# EAGLE schematic ADQ_DIP (EAGLE 6.2)
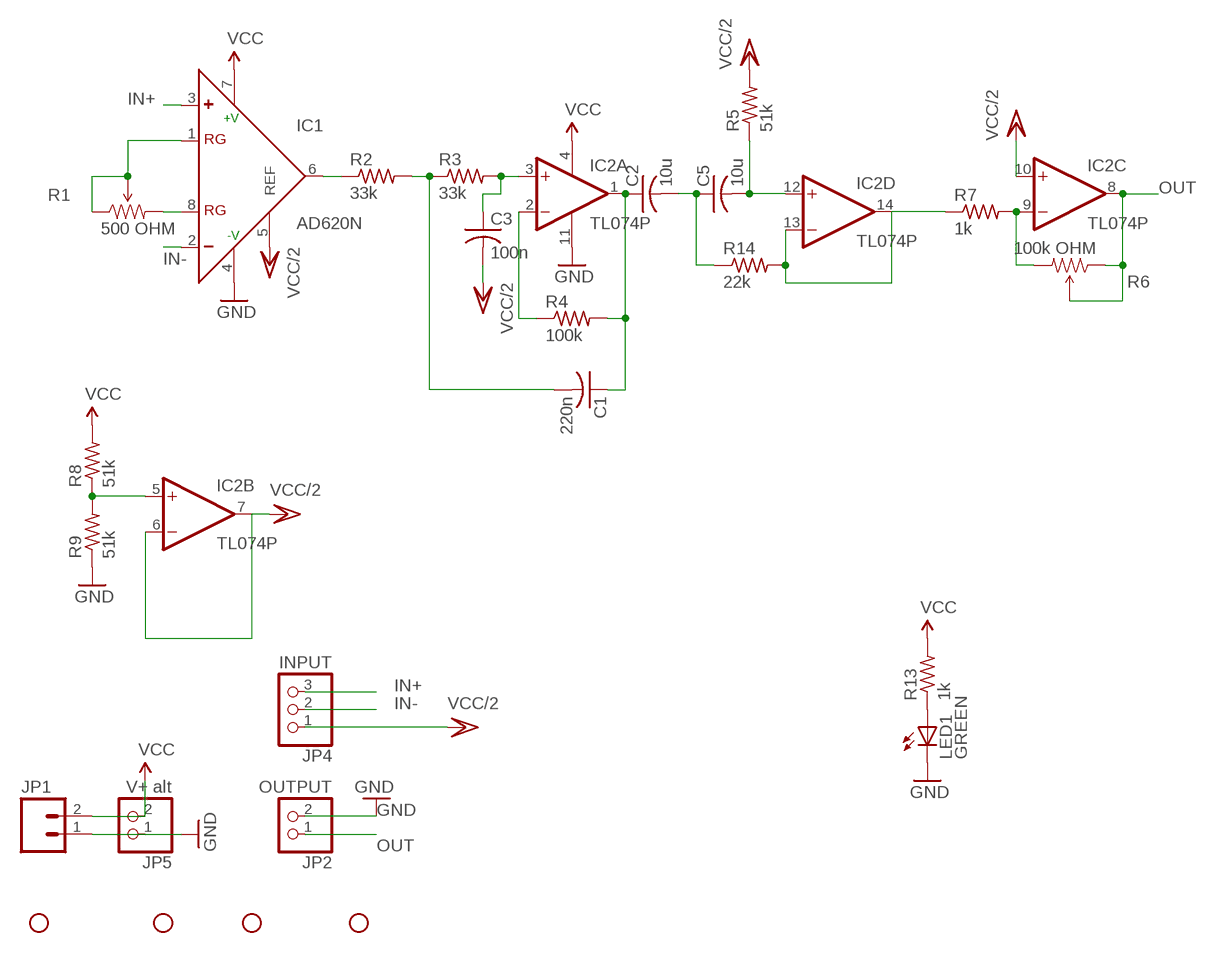
[diagram p0: schematic, sheet 1]

## Parts
C1  220n  C-USC0805  [C0805]
C2  10u  C-USC0805  [C0805]
C3  100n  C-USC0805  [C0805]
C5  10u  C-USC0805  [C0805]
IC1  AD620N  [DIL08]
IC2  TL074P  [DIL14]
JP1  M02JST-PTH-2  [JST-2-PTH]
JP2  OUTPUT  PINHD-1X2  [1X02]
JP3  STAND-OFF  [STAND-OFF]
JP4  INPUT  PINHD-1X3  [1X03]
JP5  V+ alt  PINHD-1X2  [1X02]
JP6  STAND-OFF  [STAND-OFF]
JP7  STAND-OFF  [STAND-OFF]
JP8  STAND-OFF  [STAND-OFF]
LED1  GREEN  LEDCHIPLED_0805  [CHIPLED_0805]
R1  500 OHM  TRIMPOT  [3362U-2]
R2  33k  R-US_R1206  [R1206]
R3  33k  R-US_R1206  [R1206]
R4  100k  R-US_R1206  [R1206]
R5  51k  R-US_R1206  [R1206]
R6  100k OHM  TRIMPOT  [3362U-2]
R7  1k  R-US_R1206  [R1206]
R8  51k  R-US_R1206  [R1206]
R9  51k  R-US_R1206  [R1206]
R13  1k  R-US_R1206  [R1206]
R14  22k  R-US_R1206  [R1206]

## Nets
GND: IC1.4(-V) IC2.11(P:V-) JP1.1 JP2.2 JP5.1 LED1.C R9.1
IN+: IC1.3(+) JP4.3
IN-: IC1.2(-) JP4.2
N$1: IC1.8(RG) R1.3(CW)
N$2: IC1.1(RG) R1.1(CCW) R1.2(WIPER)
N$3: C1.2 R2.2 R3.1
N$4: IC1.6(OUT) R2.1
N$5: C3.1 IC2.3(A:+IN) R3.2
N$6: IC2.2(A:-IN) R4.1
N$7: C1.1 C2.1 IC2.1(A:OUT) R4.2
N$8: LED1.A R13.1
N$9: C2.2 C5.1 R14.1
N$10: IC2.13(D:-IN) IC2.14(D:OUT) R7.1 R14.2
N$11: IC2.5(B:+IN) R8.1 R9.2
N$13: IC2.9(C:-IN) R6.3(CW) R7.2
N$15: C5.2 IC2.12(D:+IN) R5.1
OUT: IC2.8(C:OUT) JP2.1 R6.1(CCW) R6.2(WIPER)
VCC: IC1.7(+V) IC2.4(P:V+) JP1.2 JP5.2 R8.2 R13.2
VCC/2: C3.2 IC1.5(REF) IC2.6(B:-IN) IC2.7(B:OUT) IC2.10(C:+IN) JP4.1 R5.2

## Library data of the parts
C1-C3 C5 = rcl:C-US: CAPACITOR, American symbol
IC1 = analog-devices:AD620: Low Cost, Low Power, Instrumentation Amplifier Source: http://www.analog.com/UploadedFiles/Data_Sheets/37793330023930AD620_e.pdf; MF: ALTERA CORPORATION; MPN: AD620AN; OC_FARNELL: 1523782; OC_NEWARK: 05F7108
IC2 = linear:TL074: OP AMP
JP1 = juanse:M02: Header 2 Standard 2-pin 0.1" header. Use with straight break away headers (SKU : PRT-00116), right angle break away headers (PRT-00553), swiss pins (PRT-00743), machine pins (PRT-00117), and female headers (PRT-00115). Molex polarized connector foot print use with SKU : PRT-08233 with associated crimp pins and housings.
JP2 JP5 = pinhead:PINHD-1X2: PIN HEADER
JP3 JP6-JP8 = SparkFun:STAND-OFF: Stand Off This is the mechanical footprint for a #4 phillips button head screw. Use the keepout ring to avoid running the screw head into surrounding components. SKU : PRT-00447
JP4 = pinhead:PINHD-1X3: PIN HEADER
LED1 = led:LED: LED OSRAM: - CHIPLED LG R971, LG N971, LY N971, LG Q971, LY Q971, LO R971, LY R971 LH N974, LH R974 LS Q976, LO Q976, LY Q976 LO Q996 - Hyper CHIPLED LW Q18S LB Q993, LB Q99A, LB R99A - SideLED LS A670, LO A670, LY A670, LG A670, LP A670 LB A673, LV A673, LT A673, LW A673 LH A674 LY A675 LS A676, LA A676, LO A676, LY A676, LW A676 LS A679, LY A679, LG A679 - Hyper Micro SIDELED® LS Y876, LA Y876, LO Y876, LY Y876 LT Y87S - SmartLED LW L88C, LW L88S LB L89C, LB L89S, LG L890 LS L89K, LO L89K, LY L89K LS L896, LA L896, LO L896, LY L896 - TOPLED LS T670, LO T670, LY T670, LG T670, LP T670 LSG T670, LSP T670, LSY T670, LOP T670, LYG T670 LG T671, LOG T671, LSG T671 LB T673, LV T673, LT T673, LW T673 LH T674 LS T676, LA T676, LO T676, LY T676, LB T676, LH T676, LSB T676, LW T676 LB T67C, LV T67C, LT T67C, LS T67K, LO T67K, LY T67K, LW E67C LS E67B, LA E67B, LO E67B, LY E67B, LB E67C, LV E67C, LT E67C LW T67C LS T679, LY T679, LG T679 LS T770, LO T770, LY T770, LG T770, LP T770 LB T773, LV T773, LT T773, LW T773 LH T774 LS E675, LA E675, LY E675, LS T675 LS T776, LA T776, LO T776, LY T776, LB T776 LHGB T686 LT T68C, LB T68C - Hyper Mini TOPLED® LB M676 - Mini TOPLED Santana® LG M470 LS M47K, LO M47K, LY M47K Source: http://www.osram.convergy.de LUXEON: - LUMILED® LXK2-PW12-R00, LXK2-PW12-S00, LXK2-PW14-U00, LXK2-PW14-V00 LXK2-PM12-R00, LXK2-PM12-S00, LXK2-PM14-U00 LXK2-PE12-Q00, LXK2-PE12-R00, LXK2-PE12-S00, LXK2-PE14-T00, LXK2-PE14-U00 LXK2-PB12-K00, LXK2-PB12-L00, LXK2-PB12-M00, LXK2-PB14-N00, LXK2-PB14-P00, LXK2-PB14-Q00 LXK2-PR12-L00, LXK2-PR12-M00, LXK2-PR14-Q00, LXK2-PR14-R00 LXK2-PD12-Q00, LXK2-PD12-R00, LXK2-PD12-S00 LXK2-PH12-R00, LXK2-PH12-S00 LXK2-PL12-P00, LXK2-PL12-Q00, LXK2-PL12-R00 Source: www.luxeon.com KINGBRIGHT: KA-3528ASYC Source: www.kingbright.com
R1 R6 = SparkFun:TRIMPOT
R2-R5 R7-R9 R13 R14 = rcl:R-US_: RESISTOR, American symbol